# Altium project SolderingStation.PrjPcb
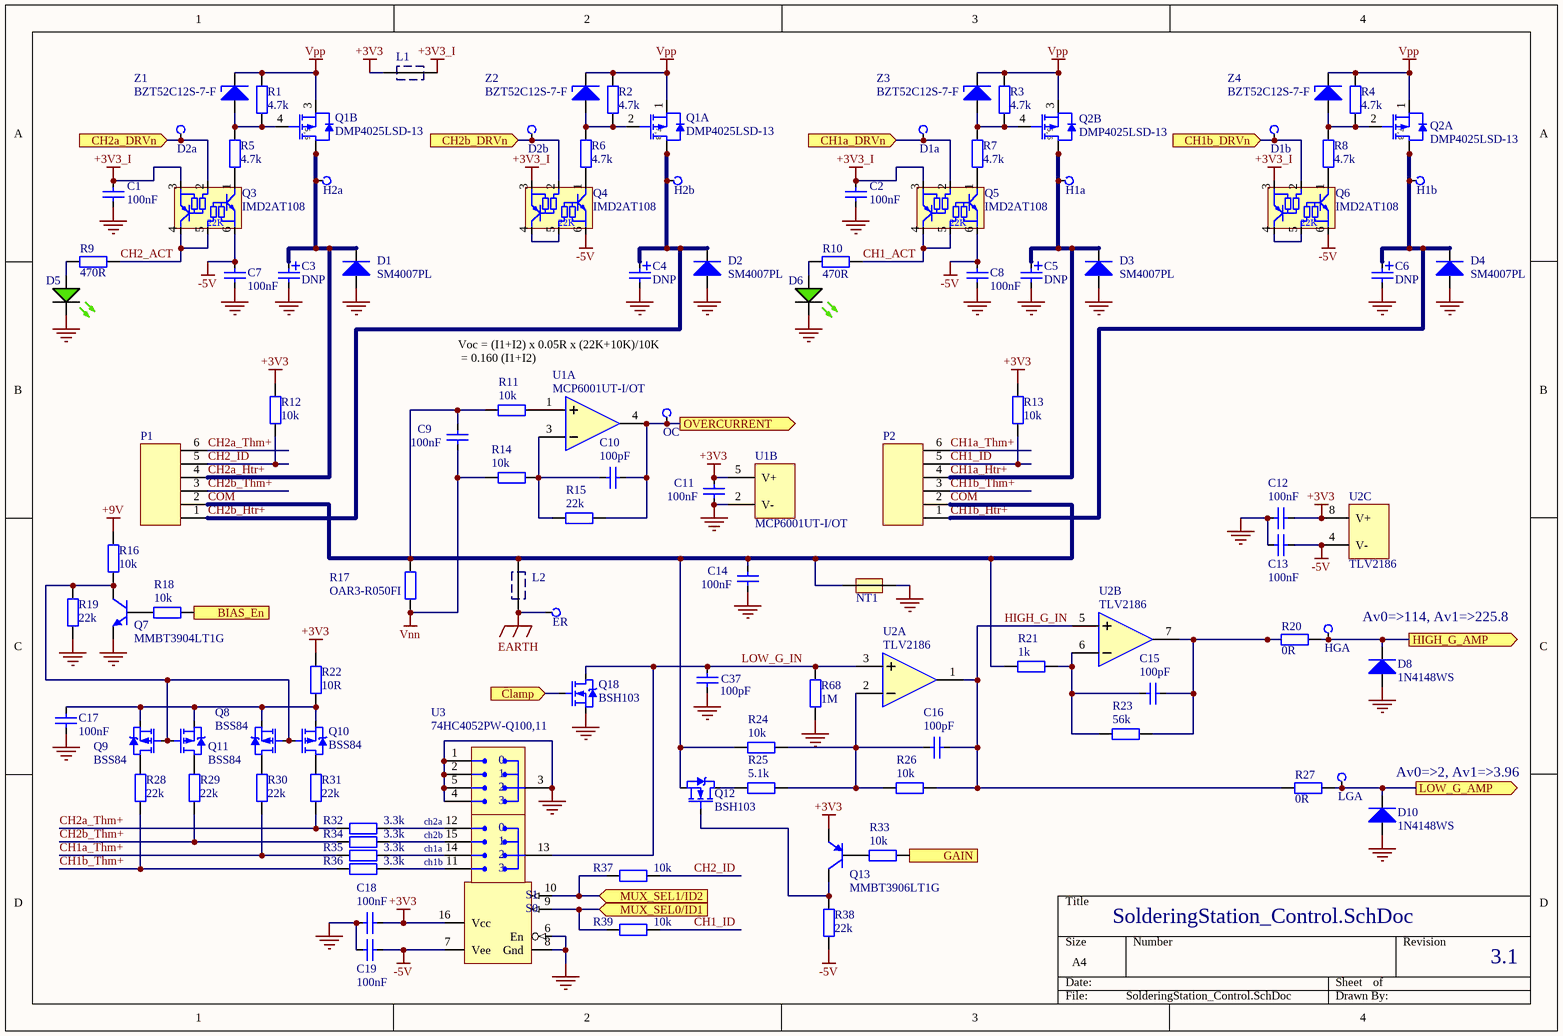
[diagram p0: SolderingStation_Control.SchDoc]
Version: 3.1
3 sheets, 209 parts. Net scope: flat (ports and power ports of the same name join across sheets).
Board file: SolderingStation_ASCII.PcbDoc
Sheets:
  SolderingStation_Control.SchDoc
  SolderingStation_Power.SchDoc
  SolderingStation_Processor.SchDoc

## Sheet SolderingStation_Control.SchDoc
size A4

### Parts
C1  100nF  [CCNP1608-0603_N]
C2  100nF  [CCNP1608-0603_N]
C3  DNP  [CC2012-0805]  (no BOM)
C4  DNP  [CC2012-0805]  (no BOM)
C5  DNP  [CC2012-0805]  (no BOM)
C6  DNP  [CC2012-0805]  (no BOM)
C7  100nF  [CCNP1608-0603_N]
C8  100nF  [CCNP1608-0603_N]
C9  100nF  [CCNP1608-0603_N]
C10  100pF  [CCNP1608-0603_N]
C11  100nF  [CCNP1608-0603_N]
C12  100nF  [CCNP1608-0603_N]
C13  100nF  [CCNP1608-0603_N]
C14  100nF  [CCNP1608-0603_N]
C15  100pF  [CCNP1608-0603_N]
C16  100pF  [CCNP1608-0603_N]
C17  100nF  [CCNP1608-0603_N]
C18  100nF  [CCNP1608-0603_N]
C19  100nF  [CCNP1608-0603_N]
C37  100pF  [CCNP1608-0603_N]
D1  SM4007PL  [SOD-123FL]
D1a  Drive1  [PCBPIN - 0.9mm]  (value not drawn)  (no BOM)
D1b  Drive2  [PCBPIN - 0.9mm]  (value not drawn)  (no BOM)
D2  SM4007PL  [SOD-123FL]
D2a  Drive2  [PCBPIN - 0.9mm]  (value not drawn)  (no BOM)
D2b  Drive2  [PCBPIN - 0.9mm]  (value not drawn)  (no BOM)
D3  SM4007PL  [SOD-123FL]
D4  SM4007PL  [SOD-123FL]
D5  LED  [LED3MM-GREEN - 10mm Proud]  (value not drawn)
D6  LED  [LED3MM-GREEN - 10mm Proud]  (value not drawn)
D8  1N4148WS  [SOD-323]
D10  1N4148WS  [SOD-323]
ER  Gnd  [PCBPIN - 0.9mm]  (value not drawn)  (no BOM)
H1a  Heater1  [PCBPIN - 0.9mm]  (value not drawn)  (no BOM)
H1b  Heater2  [PCBPIN - 0.9mm]  (value not drawn)  (no BOM)
H2a  Heater2  [PCBPIN - 0.9mm]  (value not drawn)  (no BOM)
H2b  Heater2  [PCBPIN - 0.9mm]  (value not drawn)  (no BOM)
HGA  TC1  [PCBPIN - 0.9mm]  (value not drawn)  (no BOM)
L1  Ferrite Bead  [FB2012-0805]  (value not drawn)
L2  Ferrite Bead  [FB2012-0805]  (value not drawn)
LGA  NTC1  [PCBPIN - 0.9mm]  (value not drawn)  (no BOM)
NT1  NetTieVia  [NetTieVia]  (value not drawn)  (net tie, no BOM)
OC  Overcurrent  [PCBPIN - 0.9mm]  (value not drawn)  (no BOM)
P1  MOLEX-43045-0612  [MOLEX-43045-0612]  (value not drawn)
P2  MOLEX-43045-0612  [MOLEX-43045-0612]  (value not drawn)
Q1  DMP4025LSD-13  [SO-8_M]  (parts A,B of 2)
Q2  DMP4025LSD-13  [SO-8_M]  (parts A,B of 2)
Q3  IMD2AT108  [SOT457_N - MIRROR]
Q4  IMD2AT108  [SOT457_N - MIRROR]
Q5  IMD2AT108  [SOT457_N - MIRROR]
Q6  IMD2AT108  [SOT457_N - MIRROR]
Q7  MMBT3904LT1G  [SOT23_N]
Q8  BSS84  [SOT23_M]
Q9  BSS84  [SOT23_M]
Q10  BSS84  [SOT23_M]
Q11  BSS84  [SOT23_M]
Q12  BSH103  [SOT23_N]
Q13  MMBT3906LT1G  [SOT23_N]
Q18  BSH103  [SOT23_N]
R1  4.7k  [CR1608-0603_N]
R2  4.7k  [CR1608-0603_N]
R3  4.7k  [CR1608-0603_N]
R4  4.7k  [CR1608-0603_N]
R5  4.7k  [CR1608-0603_N]
R6  4.7k  [CR1608-0603_N]
R7  4.7k  [CR1608-0603_N]
R8  4.7k  [CR1608-0603_N]
R9  470R  [CR1608-0603_N]
R10  470R  [CR1608-0603_N]
R11  10k  [CR1608-0603_N]
R12  10k  [CR1608-0603_N]
R13  10k  [CR1608-0603_N]
R14  10k  [CR1608-0603_N]
R15  22k  [CR1608-0603_N]
R16  10k  [CR1608-0603_N]
R17  OAR3-R050FI  [OAR3-R050FI]
R18  10k  [CR1608-0603_N]
R19  22k  [CR1608-0603_N]
R20  0R  [CR1608-0603_N]
R21  1k  [CR1608-0603_N]
R22  10R  [CR1608-0603_N]
R23  56k  [CR1608-0603_N]
R24  10k  [CR1608-0603_N]
R25  5.1k  [CR1608-0603_N]
R26  10k  [CR1608-0603_N]
R27  0R  [CR1608-0603_N]
R28  22k  [CR1608-0603_N]
R29  22k  [CR1608-0603_N]
R30  22k  [CR1608-0603_N]
R31  22k  [CR1608-0603_N]
R32  3.3k  [CR1608-0603_N]
R33  10k  [CR1608-0603_N]
R34  3.3k  [CR1608-0603_N]
R35  3.3k  [CR1608-0603_N]
R36  3.3k  [CR1608-0603_N]
R37  10k  [CR1608-0603_N]
R38  22k  [CR1608-0603_N]
R39  10k  [CR1608-0603_N]
R68  1M  [CR1608-0603_N]
U1  MCP6001UT-I/OT  [SOT23-5_M]  (parts A,B of 2)
U2  TLV2186  [SOIC127P600-8M]  (parts A,B,C of 3)
U3  74HC4052PW-Q100,11  [TSSOP16_M]
Z1  BZT52C12S-7-F  [SOD-323]
Z2  BZT52C12S-7-F  [SOD-323]
Z3  BZT52C12S-7-F  [SOD-323]
Z4  BZT52C12S-7-F  [SOD-323]

### Ports
BIAS_En (in), CH1a_DRVn (in), CH1b_DRVn (in), CH2a_DRVn (in), CH2b_DRVn (in), Clamp (in), GAIN (in), HIGH_G_AMP (out), LOW_G_AMP (out), MUX_SEL0/ID1 (in), MUX_SEL1/ID2 (in), OVERCURRENT (out)

### Nets
+3V3: C11.1 C12.1 C18.1 L1.1 Q13.2(E) R12.2 R13.2 R22.1 U1.5(V+) U2.8(V+) U3.16(Vcc)
+3V3_I: C1.1 C2.1 L1.2 Q3.3(E2) Q4.3(E2) Q5.3(E2) Q6.3(E2)
+9V: R16.1
-5V: C7.1 C8.1 C13.1 C19.1 Q3.6(E1) Q4.6(E1) Q5.6(E1) Q6.6(E1) R38.1 U2.4(V-) U3.7(Vee)
EARTH: ER.1(TP) L2.1
GND: C1.2 C2.2 C3.2 C4.2 C5.2 C6.2 C7.2 C8.2 C11.2 C12.2 C13.2 C14.2 C17.1 C18.2 C19.2 C37.1 D1.A D2.A D3.A D4.A D5.K D6.K D8.A D10.A NT1.1 Q7.2(E) Q18.2(S) R19.1 R68.1 U1.2(V-) U3.1(2Y0) U3.2(2Y2) U3.3(2Z) U3.4(2Y3) U3.5(2Y1) U3.6(En) U3.8(Gnd)
Vnn: C9.2 R14.2 R17.1
Vpp: Q1.1(S1) Q1.3(S2) Q2.1(S1) Q2.3(S2) R1.2 R2.2 R3.2 R4.2 Z1.K Z2.K Z3.K Z4.K
BIAS_En: R18.2 ; port BIAS_En
CH1_ACT: Q5.4(C2) Q5.5(B1) R10.2
CH1_ID: P2.5 R13.1 R39.1
CH1a_DRVn: D1a.1(TP) Q5.2(B2) ; port CH1a_DRVn
CH1a_Htr+: C5.1 D3.K H1a.1(TP) P2.4 Q2.5(D2) Q2.6(D2)
CH1a_Thm+: P2.6 R30.1 R35.2
CH1b_DRVn: D1b.1(TP) Q6.2(B2) ; port CH1b_DRVn
CH1b_Htr+: C6.1 D4.K H1b.1(TP) P2.1 Q2.7(D1) Q2.8(D1)
CH1b_Thm+: P2.3 R28.1 R36.2
CH2_ACT: Q3.4(C2) Q3.5(B1) R9.2
CH2_ID: P1.5 R12.1 R37.1
CH2a_DRVn: D2a.1(TP) Q3.2(B2) ; port CH2a_DRVn
CH2a_Htr+: C3.1 D1.K H2a.1(TP) P1.4 Q1.5(D2) Q1.6(D2)
CH2a_Thm+: P1.6 R31.1 R32.2
CH2b_DRVn: D2b.1(TP) Q4.2(B2) ; port CH2b_DRVn
CH2b_Htr+: C4.1 D2.K H2b.1(TP) P1.1 Q1.7(D1) Q1.8(D1)
CH2b_Thm+: P1.3 R29.1 R34.2
Clamp: Q18.1(G) ; port Clamp
COM: C9.1 C14.1 L2.2 NT1.2 P1.2 P2.2 Q12.2(S) R11.2 R17.2 R21.2 R24.1
GAIN: R33.2 ; port GAIN
HIGH_G_AMP: D8.K HGA.1(TP) R20.1 ; port HIGH_G_AMP
HIGH_G_IN: C16.2 R26.2 R27.2 U2.1(A) U2.5(B+)
LOW_G_AMP: D10.K LGA.1(TP) R27.1 ; port LOW_G_AMP
LOW_G_IN: C37.2 Q18.3(D) R68.2 U2.3(A+) U3.13(1Z)
MUX_SEL0/ID1: R39.2 U3.9(S1) ; port MUX_SEL0/ID1
MUX_SEL1/ID2: R37.2 U3.10(S0) ; port MUX_SEL1/ID2
OVERCURRENT: C10.2 OC.1(TP) R15.2 U1.4(Out) ; port OVERCURRENT
NetC10_1: C10.1 R14.1 R15.1 U1.3(In-)
NetC15_1: C15.1 R21.1 R23.1 U2.6(B-)
NetC15_2: C15.2 R20.2 R23.2 U2.7
NetC16_1: C16.1 R24.2 R25.1 R26.1 U2.2(A-)
NetC17_2: C17.2 Q8.2(S) Q9.2(S) Q10.2(S) Q11.2(S) R22.2
NetD5_A: D5.A R9.1
NetD6_A: D6.A R10.1
NetQ1_2: Q1.2(G1) R2.1 R6.2 Z2.A
NetQ1_4: Q1.4(G2) R1.1 R5.2 Z1.A
NetQ2_2: Q2.2(G1) R4.1 R8.2 Z4.A
NetQ2_4: Q2.4(G2) R3.1 R7.2 Z3.A
NetQ3_1: Q3.1(C1) R5.1
NetQ4_1: Q4.1(C1) R6.1
NetQ4_4: Q4.4(C2) Q4.5(B1)
NetQ5_1: Q5.1(C1) R7.1
NetQ6_1: Q6.1(C1) R8.1
NetQ6_4: Q6.4(C2) Q6.5(B1)
NetQ7_1: Q7.1(B) R18.1
NetQ7_3: Q7.3(C) Q8.1(G) Q9.1(G) Q10.1(G) Q11.1(G) R16.2 R19.2
NetQ8_3: Q8.3(D) R30.2
NetQ9_3: Q9.3(D) R28.2
NetQ10_3: Q10.3(D) R31.2
NetQ11_3: Q11.3(D) R29.2
NetQ12_1: Q12.1(G) Q13.3(C) R38.2
NetQ12_3: Q12.3(D) R25.2
NetQ13_1: Q13.1(B) R33.1
NetR11_1: R11.1 U1.1(In+)
NetR32_1: R32.1 U3.12(1Y0)
NetR34_1: R34.1 U3.15(1Y2)
NetR35_1: R35.1 U3.14(1Y1)
NetR36_1: R36.1 U3.11(1Y3)

### Notes on the sheet
- Voc = (I1+I2) x 0.05R x (22K+10K)/10K
  = 0.160 (I1+I2)
- Av0=>114, Av1=>225.8
- (near D10) Av0=>2, Av1=>3.96
- (near U3) ch1a
- (near U3) ch2a
- (near U3) ch2b
- (near U3) ch1b
- (in symbol 74HC4052PW-Q100,11) 0
- (in symbol DMP4025LSD-13, part A) 7, 8
- (in symbol DMP4025LSD-13, part B) 5, 6
- (in symbol IMD2AT108) 22K

### Library data of the parts
C1 C2 C7-C9 C11-C14 C17-C19 = Cap_CCNP_0603_100nF: Capacitor non-polar SMT 0603; Manufacturer: Generic Components; Class: Passive; Published: 08/06/2000; Publisher: Altium Hobart Technology Centre; SubClass: Capacitor; Farnell PN: *; Digikey: *; Value: 100nF; LCSC: C14663
C3-C6 = Cap_CC_0805: Capacitor SMT 0805; Manufacturer: Generic Components; Class: Passive; Published: 08/06/2000; Publisher: Altium Hobart Technology Centre; SubClass: Capacitor; Farnell PN: *; Digikey: *; Value: DNP
C10 C15 C16 C37 = Cap_CCNP_0603_100pF: Capacitor non-polar SMT 0603; Manufacturer: Generic Components; Class: Passive; Published: 08/06/2000; Publisher: Altium Hobart Technology Centre; SubClass: Capacitor; Farnell PN: *; Digikey: *; Value: 100pF; LCSC: C14858
D1-D4 = SM4007PL: Diodes - General Purpose, 1kV 1A 1.1V 1A SOD-123FL; Class: Discrete; SubClass: Diode - Switching; Digikey: *; Farnell PN: *; LCSC: C64898
D1a D1b D2a D2b ER H1a H1b H2a H2b HGA LGA OC = TP: Test Point; Digikey: *; Farnell PN: *; LCSC: *
D5 D6 = LED_3MM_GREEN: 3mm Green LED; Manufacturer: Generic Components; Class I: Optoelectronic; Published: 8-Jun-2000; Revision: July-2002: Re-released for DXP Platform.; Publisher: Altium Limited; Class II: LED; Digikey: *; Farnell PN: *; LCSC: *
D8 D10 = 1N4148WS: Switching Diode 100V 150mA 1.25V@150mA 4ns SOD-323; Class: Discrete; SubClass: Diode - Switching; Digikey: *; Farnell PN: 2675146; LCSC: C2128
L1 L2 = Ferrite Bead 0805: Ferrite Bead SMT 0805, TDK MPZ2012S102AT, 0.15OHM, 1.5A; Farnell PN: 1669733; Digikey: *; LCSC: C1017
P1 P2 = MOLEX-43045-0612: Wire-To-Board Connector, With Polarizing Peg, 3 mm, 6 Contacts, Header, Micro-Fit 3.0 43045 Series; Farnell PN: 1012248
Q1 Q2 = DMP4025LSD-13: P-Channel dual MOSFET, 40 V, 7.6 A, 0.018 ohm, SOIC, Surface Mount; Farnell: 2543521
Q3-Q6 = IMD2AT108: Pre-Biased NPN and PNP pair, 50 V, 100 mA, 22 kohm, 22 kohm; LCSC: C509889; Farnell PN: 1680329
Q7 = MMBT3904LT1G: General Purpose Transistor, NPN Silicon, 3-Pin SOT-23, Pb-Free, Tape and Reel; Manufacturer: On Semiconductor; IC Continuous (A): 0.2; fT Min (MHz): 300; ComponentLink2Description: Datasheet; Polarity: NPN; PackageDescription: 3-Pin Small Outline Transistor, Body 2.92 x 1.3 mm, Pitch 0.95 mm; ComponentLink2URL: http://www.onsemi.cn/pub_link/Collateral/MMBT3904LT1-D.PDF; DatasheetVersion: Rev. 12; Mounting Technology: Surface Mount; PartNumber: MMBT3904LT1G; ComponentLink1URL: http://www.onsemi.com/; ComponentLink3Description: Package Specification; ComponentLink1Description: Manufacturer URL; PackageVersion: Rev. AP, 11/2009; PackageReference: SOT-23-3-318-08; Packing: Tape and Reel; ComponentLink3URL: http://www.onsemi.cn/pub_link/Collateral/318-08.PDF; RoHS: TRUE; LCSC: C20526
Q8-Q11 = BSS84: P-Channel Enhancement Mode FET -0.13 A, -50 V,  RDS(ON) = 10R at VGS = -5 V; Digikey: *; Farnell PN: *; LCSC: C8492
Q12 Q18 = BSH103: N-channel enhancement mode FET, , 30 V, 850 mA, 0.4 ohm, SOT23; PackageDescription: SOT-23; 3 Leads; Body 3.1 x 2.5 mm, inc. leads (LxW max), Alternate Lead Configuration; ComponentLink1Description: Manufacturer Link; ComponentLink1URL: http://www.zetex.com/; ComponentLink2Description: Datasheet; ComponentLink2URL: www.zetex.com/3.0/pdf/BSS138.pdf; Farnell PN: 1081307; Digikey: *; LCSC: C88711
Q13 = MMBT3906LT1G: General Purpose Transistor, PNP Silicon, 3-Pin SOT-23, Pb-Free, Tape and Reel; Manufacturer: On Semiconductor; IC Continuous (A): -0.2; fT Min (MHz): 250; PackageDescription: 3-Pin Small Outline Transistor, Body 2.92 x 1.3 mm, Pitch 0.95 mm; PartNumber: MMBT3906LT1G; Packing: Tape and Reel; ComponentLink3Description: Package Specification; Mounting Technology: Surface Mount; ComponentLink3URL: http://www.onsemi.cn/pub_link/Collateral/318-08.PDF; ComponentLink1URL: http://www.onsemi.com/; ComponentLink2URL: http://www.onsemi.cn/pub_link/Collateral/MMBT3906LT1-D.PDF; PackageReference: SOT-23-3-318-08; Polarity: PNP; ComponentLink2Description: Datasheet; PackageVersion: Rev. AP, 11/2009; RoHS: TRUE; DatasheetVersion: Rev. 11; ComponentLink1Description: Manufacturer URL; LCSC: C53444
R1-R8 = Res_CR0603_4k7: Resistor SMT 0603; Manufacturer: Generic Components; Class: Passive; Published: 08/06/2000; Publisher: Altium Hobart Technology Centre; SubClass: Resistor; Farnell PN: *; Digikey: *; LCSC: C23162; Value: 4.7k
R9 R10 = Res_CR0603_470R: Resistor SMT 0603; Manufacturer: Generic Components; Class: Passive; Published: 08/06/2000; Publisher: Altium Hobart Technology Centre; SubClass: Resistor; Farnell PN: *; Digikey: *; Value: 470R; LCSC: C23179
R11-R14 R16 R18 R24 R26 R33 R37 R39 = Res_CR0603_10k: Resistor SMT 0603; Manufacturer: Generic Components; Class: Passive; Published: 08/06/2000; Publisher: Altium Hobart Technology Centre; SubClass: Resistor; Farnell PN: *; Digikey: *; Value: 10k; LCSC: C25804
R15 R19 R28-R31 R38 = Res_CR0603_22k: Resistor SMT 0603; Manufacturer: Generic Components; Class: Passive; Published: 08/06/2000; Publisher: Altium Hobart Technology Centre; SubClass: Resistor; Farnell PN: *; Digikey: *; LCSC: C31850; Value: 22k
R17 = OAR3-R050FI: Current Sense Resistor, 0.05 ohm, OAR Series, 3 W, Metal Strip, Radial Leaded, 1%
R20 R27 = Res_CR0603_0R: Resistor SMT 0603; Manufacturer: Generic Components; Class: Passive; Published: 08/06/2000; Publisher: Altium Hobart Technology Centre; SubClass: Resistor; Farnell PN: *; Digikey: *; LCSC: C21189; Value: 0R
R21 = Res_CR0603_1k: Resistor SMT 0603; Manufacturer: Generic Components; Class: Passive; Published: 08/06/2000; Publisher: Altium Hobart Technology Centre; SubClass: Resistor; Farnell PN: *; Digikey: *; LCSC: C21190; Value: 1k
R22 = Res_CR0603_10R: Resistor SMT 0603; Manufacturer: Generic Components; Class: Passive; Published: 08/06/2000; Publisher: Altium Hobart Technology Centre; SubClass: Resistor; Farnell PN: *; Digikey: *; Value: 10R; LCSC: C22978
R23 = Res_CR0603_56k: Resistor SMT 0603; Manufacturer: Generic Components; Class: Passive; Published: 08/06/2000; Publisher: Altium Hobart Technology Centre; SubClass: Resistor; Farnell PN: *; Digikey: *; LCSC: C23206; Value: 56k
R25 = Res_CR0603_5k1: Resistor SMT 0603; Manufacturer: Generic Components; Class: Passive; Published: 08/06/2000; Publisher: Altium Hobart Technology Centre; SubClass: Resistor; Farnell PN: *; Digikey: *; LCSC: C23186; Value: 5.1k
R32 R34-R36 = Res_CR0603_3k3: Resistor SMT 0603; Manufacturer: Generic Components; Class: Passive; Published: 08/06/2000; Publisher: Altium Hobart Technology Centre; SubClass: Resistor; Farnell PN: *; Digikey: *; LCSC: C22978; Value: 3.3k
R68 = Res_CR0603_1M: Resistor SMT 0603; Manufacturer: Generic Components; Class: Passive; Published: 08/06/2000; Publisher: Altium Hobart Technology Centre; SubClass: Resistor; Farnell PN: *; Digikey: *; LCSC: C25804; Value: 1M
U1 = MCP6001UT-I/OT: Op-Amp, Single supply R-R in/out; Digikey: *; Farnell PN: *; LCSC: C21403
U2 = TLV2186: Dual Precision,Rail-to-Rail Input and Output, 4.5-24V, Zero-Drift OperationalAmplifier
U3 = 74HC4052PW-Q100,11: Analog Multiplexer / Demultiplexer, 4:1, 2 Circuits, 225 ohm, 2V to 10V, TSSOP-16; Farnell PN: 2445305; LCSC: C547006
Z1-Z4 = BZT52C12S-7-F: Surface Mount Zener Diode, 12-13 V, -65 to 150 degC, SOD-123; LCSC: C124208
NT1 = NetTieVia: LCSC: *

## Sheet SolderingStation_Power.SchDoc
size A4
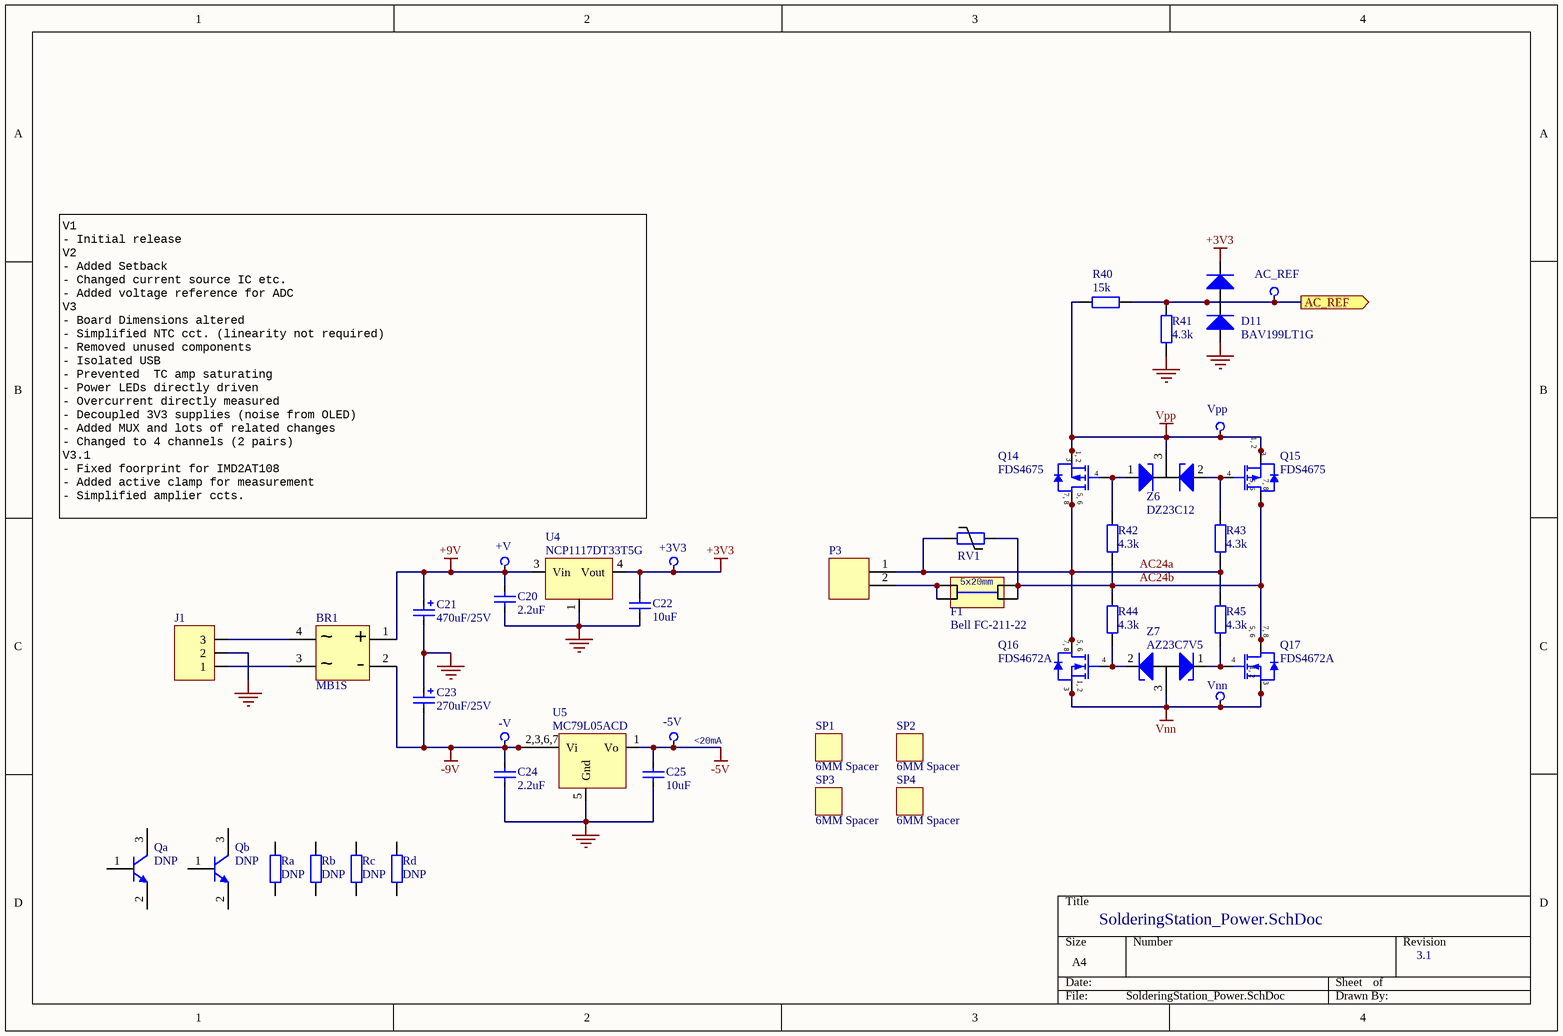
[diagram p1: SolderingStation_Power.SchDoc]

### Parts
+3V3  +3.3 volt  [PCBPIN - 0.9mm]  (value not drawn)  (no BOM)
+V  9 volt unregulated  [PCBPIN - 0.9mm]  (value not drawn)  (no BOM)
-5V  -5 volt  [PCBPIN - 0.9mm]  (value not drawn)  (no BOM)
-V  -9 volt unregulated  [PCBPIN - 0.9mm]  (value not drawn)  (no BOM)
AC_REF  Vdd  [PCBPIN - 0.9mm]  (value not drawn)  (no BOM)
BR1  MB1S  [MB1S]
C20  2.2uF  [CCNP2012-0805]
C21  470uF/25V  [RB5/10x13mm]
C22  10uF  [CCNP2012-0805]
C23  270uF/25V  [RB5/10x13mm]
C24  2.2uF  [CCNP2012-0805]
C25  10uF  [CCNP2012-0805]
D11  BAV199LT1G  [SOT23_M]
F1  Bell FC-211-22  [FUSE_CLIP_5x20]
J1  JST XH Connector, 3-Pin  [jst-b3b-xh-ax]  (value not drawn)
P3  Terminal2  [MOLEX-39544-3002]  (value not drawn)
Q14  FDS4675  [SO-8_M]
Q15  FDS4675  [SO-8_M]
Q16  FDS4672A  [SO-8_M]
Q17  FDS4672A  [SO-8_M]
Qa  DNP  [SOT23_M]  (no BOM)
Qb  DNP  [SOT23_M]  (no BOM)
R40  15k  [CR1608-0603_N]
R41  4.3k  [CR1608-0603_N]
R42  4.3k  [CR1608-0603_N]
R43  4.3k  [CR1608-0603_N]
R44  4.3k  [CR1608-0603_N]
R45  4.3k  [CR1608-0603_N]
Ra  DNP  [CR1608-0603_N]  (no BOM)
Rb  DNP  [CR1608-0603_N]  (no BOM)
Rc  DNP  [CR1608-0603_N]  (no BOM)
Rd  DNP  [CR1608-0603_N]  (no BOM)
RV1  V33MLA1206NHAUTO  [VR3216-1206]  (value not drawn)
SP1  6MM Spacer  [Spacer-2mm dia x 6mm]
SP2  6MM Spacer  [Spacer-2mm dia x 6mm]
SP3  6MM Spacer  [Spacer-2mm dia x 6mm]
SP4  6MM Spacer  [Spacer-2mm dia x 6mm]
U4  NCP1117DT33T5G  [TO-252]
U5  MC79L05ACD  [SOIC127P600-8N]
Vnn  Power Ground  [PCBPIN - 0.9mm]  (value not drawn)  (no BOM)
Vpp  Power +V  [PCBPIN - 0.9mm]  (value not drawn)  (no BOM)
Z6  DZ23C12  [SOT23_M]
Z7  AZ23C7V5  [SOT23_M]

### Ports
AC_REF (out)

### Nets
+3V3: +3V3.1(TP) C22.2 D11.2(A2) U4.4(Vout)
+9V: +V.1(TP) BR1.1 C20.2 C21.1 U4.3(Vin)
-5V: -5V.1(TP) C25.2 U5.1(Vo)
-9V: -V.1(TP) BR1.2 C23.2 C24.2 U5.2(Vi) U5.3(Vi) U5.6(Vi) U5.7(Vi)
GND: C20.1 C21.2 C22.1 C23.1 C24.1 C25.1 D11.1(A1) J1.2 R41.1 U4.1(Gnd) U5.5(Gnd)
Vnn: Q16.1(S) Q16.2(S) Q16.3(S) Q17.1(S) Q17.2(S) Q17.3(S) Vnn.1(TP) Z7.3(K)
Vpp: Q14.1(S) Q14.2(S) Q14.3(S) Q15.1(S) Q15.2(S) Q15.3(S) R40.1 Vpp.1(TP) Z6.3(K)
AC24a: P3.1 Q14.5(D) Q14.6(D) Q14.7(D) Q14.8(D) Q16.5(D) Q16.6(D) Q16.7(D) Q16.8(D) R43.1 R45.2 RV1.2
AC24b: F1.2 F1.2a Q15.5(D) Q15.6(D) Q15.7(D) Q15.8(D) Q17.5(D) Q17.6(D) Q17.7(D) Q17.8(D) R42.1 R44.2 RV1.1
AC_REF: AC_REF.1(TP) D11.3(K) R40.2 R41.2 ; port AC_REF
NetBR1_3: BR1.3 J1.1
NetBR1_4: BR1.4 J1.3
NetF1_1: F1.1 F1.1a P3.2
NetQ14_4: Q14.4(G) R42.2 Z6.1(A1)
NetQ15_4: Q15.4(G) R43.2 Z6.2(A2)
NetQ16_4: Q16.4(G) R44.1 Z7.2(A2)
NetQ17_4: Q17.4(G) R45.1 Z7.1(A1)

Not connected (* = marked no-connect by the designer): Qa 1(B) 2(E) 3(C); Qb 1(B) 2(E) 3(C); Ra 1 2; Rb 1 2; Rc 1 2; Rd 1 2; U5 4(NC) 8(NC)

### Notes on the sheet
- V1
  - Initial release
  V2
  - Added Setback
  - Changed current source IC etc.
  - Added voltage reference for ADC
  V3
  - Board Dimensions altered
  - Simplified NTC cct. (linearity not required)
  - Removed unused components
  - Isolated USB
  - Prevented  TC amp saturating
  - Power LEDs directly driven
  - Overcurrent directly measured
  - Decoupled 3V3 supplies (noise from OLED)
  - Added MUX and lots of related changes
  - Changed to 4 channels (2 pairs)
  V3.1
  - Fixed foorprint for IMD2AT108
  - Added active clamp for measurement
  - Simplified amplier ccts.
- (near -5V) <20mA
- (in symbol FDS4672A) 7, 8; 5, 6; 1, 2
- (in symbol FUSE_CLIP_5x20) 5x20mm
- (in symbol MB1S) ~; +; -
- (in symbol MC79L05ACD) 2,3,6,7
- (in symbol IMD2AT108) 22K

### Library data of the parts
+3V3 +V -5V -V AC_REF Vnn Vpp = TP: Test Point; Digikey: *; Farnell PN: *; LCSC: *
BR1 = MB1S: Bridge Rectifier Diode, Single Phase, 100 V, 800 mA, SOIC, 1.1 V, 4 Pins; LCSC: C232821
C20 C24 = Cap_CCNP_0805_2u2F: Capacitor non-polar SMT 0805; Manufacturer: Generic Components; Class: Passive; Published: 08/06/2000; Publisher: Altium Hobart Technology Centre; SubClass: Capacitor; Farnell PN: *; Digikey: *; LCSC: C49217; Value: 2.2uF
C21 C23 = Cap-RB5/10x16MM
  C21: value: 470uF/25V
  C23: value: 270uF/25V
C22 C25 = Cap_CCNP_0805_10uF: Capacitor non-polar SMT 0805; Manufacturer: Generic Components; Class: Passive; Published: 08/06/2000; Publisher: Altium Hobart Technology Centre; SubClass: Capacitor; Farnell PN: *; Digikey: *; Value: 10uF; LCSC: C15850
D11 = BAV199LT1G: Dual Series low-leakage switching diodes, 3-Pin SOT-23; Digikey: BAV199LT1GOSCT-ND; Farnell PN: 1431115; LCSC: C145516
F1 = FUSE_CLIP_5x20: 5x20mm fuse clip PCB Mount; Value: 10 A; Digikey: 507-1415-ND
J1 = JST-B3B-XH-A: LatestRevisionDate: 17-Jul-2002; LatestRevisionNote: Re-released for DXP Platform.; Publisher: Altium Limited; LCSC: *; Farnell PN: 1516277; Digikey: 455-2248-ND
P3 = Terminal2: MULTICOMP  MC24366 Wire-To-Board Terminal Block; Farnell PN: 2396251; LCSC: *
Q14 Q15 = FDS4675: P-Channel Power MOSFET, 11 A, 40 V, RDS(ON) = 0.013 ohm @ VGS = -10   VRDS(ON) = 0.017 ohm @ VGS =   -4.5 VC; Manufacturer: Fairchild Semiconductor; Package Version: Rev. 16, 08/2015; Qg Gate Charge: 56nC; Drain-to-Source Voltage [Vdss]: 40V; Drain-Source On Resistance-Max: 13mO; Rated Power Dissipation: 2.4W; Datasheet Version: Rev. C(W), 02/2001; Package Description: 8-Pin Small Outline Integrated Circuit, Body 4.9 x 3.9 mm, Pitch 1.27 mm; Channel Type: P-Channel; Datasheet URL: https://www.fairchildsemi.com/datasheets/FD/FDS4675.pdf; Package URL: https://www.fairchildsemi.com/package-drawings/M0/M08A.pdf; Package Reference: SO-8; Mounting Technology: SurfaceMount; Manufacturer URL: https://www.fairchildsemi.com/; Temperature: 25
Q16 Q17 = FDS4672A: N-Channel Power MOSFET, 11 A, 40 V. RDS(ON)  = .013 ohm @ VGS = 4.5 V; Manufacturer: Fairchild Semiconductor; Package Version: Rev. 16, 08/2015; Channel Type: P-Channel; Qg Gate Charge: 56nC; Drain-to-Source Voltage [Vdss]: 40V; Drain-Source On Resistance-Max: 13mO; Rated Power Dissipation: 2.4W; Datasheet Version: Rev. C(W), 02/2001; Package Description: 8-Pin Small Outline Integrated Circuit, Body 4.9 x 3.9 mm, Pitch 1.27 mm; Datasheet URL: https://www.fairchildsemi.com/datasheets/FD/FDS4675.pdf; Package URL: https://www.fairchildsemi.com/package-drawings/M0/M08A.pdf; Package Reference: SO-8; Mounting Technology: SurfaceMount; Manufacturer URL: https://www.fairchildsemi.com/; LCSC: C725034
Qa Qb = MMBT3904LT1G: SOT23; ComponentLink2Description: Datasheet; ComponentLink2URL: http://www.onsemi.cn/pub_link/Collateral/MMBT3904LT1-D.PDF; ComponentLink1URL: http://www.onsemi.com/; ComponentLink3Description: Package Specification; ComponentLink1Description: Manufacturer URL; ComponentLink3URL: http://www.onsemi.cn/pub_link/Collateral/318-08.PDF
R40 = Res_CR0603_15k: Resistor SMT 0603; Manufacturer: Generic Components; Class: Passive; Published: 08/06/2000; Publisher: Altium Hobart Technology Centre; SubClass: Resistor; Farnell PN: *; Digikey: *; LCSC: C22809; Value: 15k
R41-R45 = Res_CR0603_4k3: Resistor SMT 0603; Manufacturer: Generic Components; Class: Passive; Published: 08/06/2000; Publisher: Altium Hobart Technology Centre; SubClass: Resistor; Farnell PN: *; Digikey: *; LCSC: C23159; Value: 4.3k
Ra Rb Rc Rd = Res_CR0603: Resistor SMT 0603; Manufacturer: Generic Components; Class: Passive; Published: 08/06/2000; Publisher: Altium Hobart Technology Centre; SubClass: Resistor; Farnell PN: *; Digikey: *; Value: DNP
RV1 = V33MLA1206NHAUTO: V33MLA1206NH - TVS Varistor, 26 V, 33 V, MLA Series, 75 V, 1206 [3216 Metric], Multilayer Varistor (MLV); Manufacturer: Generic Components; Class: Passive; SubClass: Resistor; Published: 08/06/2000; Publisher: Altium Hobart Technology Centre; Farnell PN: 1816942; Digikey: F11298CT-ND; LCSC: *
SP1-SP4 = Spacer-6mm
U4 = NCP1117DT33T5G: IC REG LINEAR +3V3 1A TO252-3; Farnel: 2464254; DigiKey: NCP1117DT33T5GOSCT-ND; LCSC: C152529
U5 = MC79L05ACD: IC REG LINEAR -5V 100MA SOIC-8; DigiKey: UA79M05CKVURG3; LCSC: C154823; Farnell PN: 3122804
Z6 = DZ23Cxx: Dual silicon planar Zener diodes; Digikey: *; Farnell PN: *; LCSC: *
Z7 = AZ23Cxx: Dual silicon planar Zener diodes; Digikey: *; Farnell PN: *; LCSC: *

## Sheet SolderingStation_Processor.SchDoc
size A4
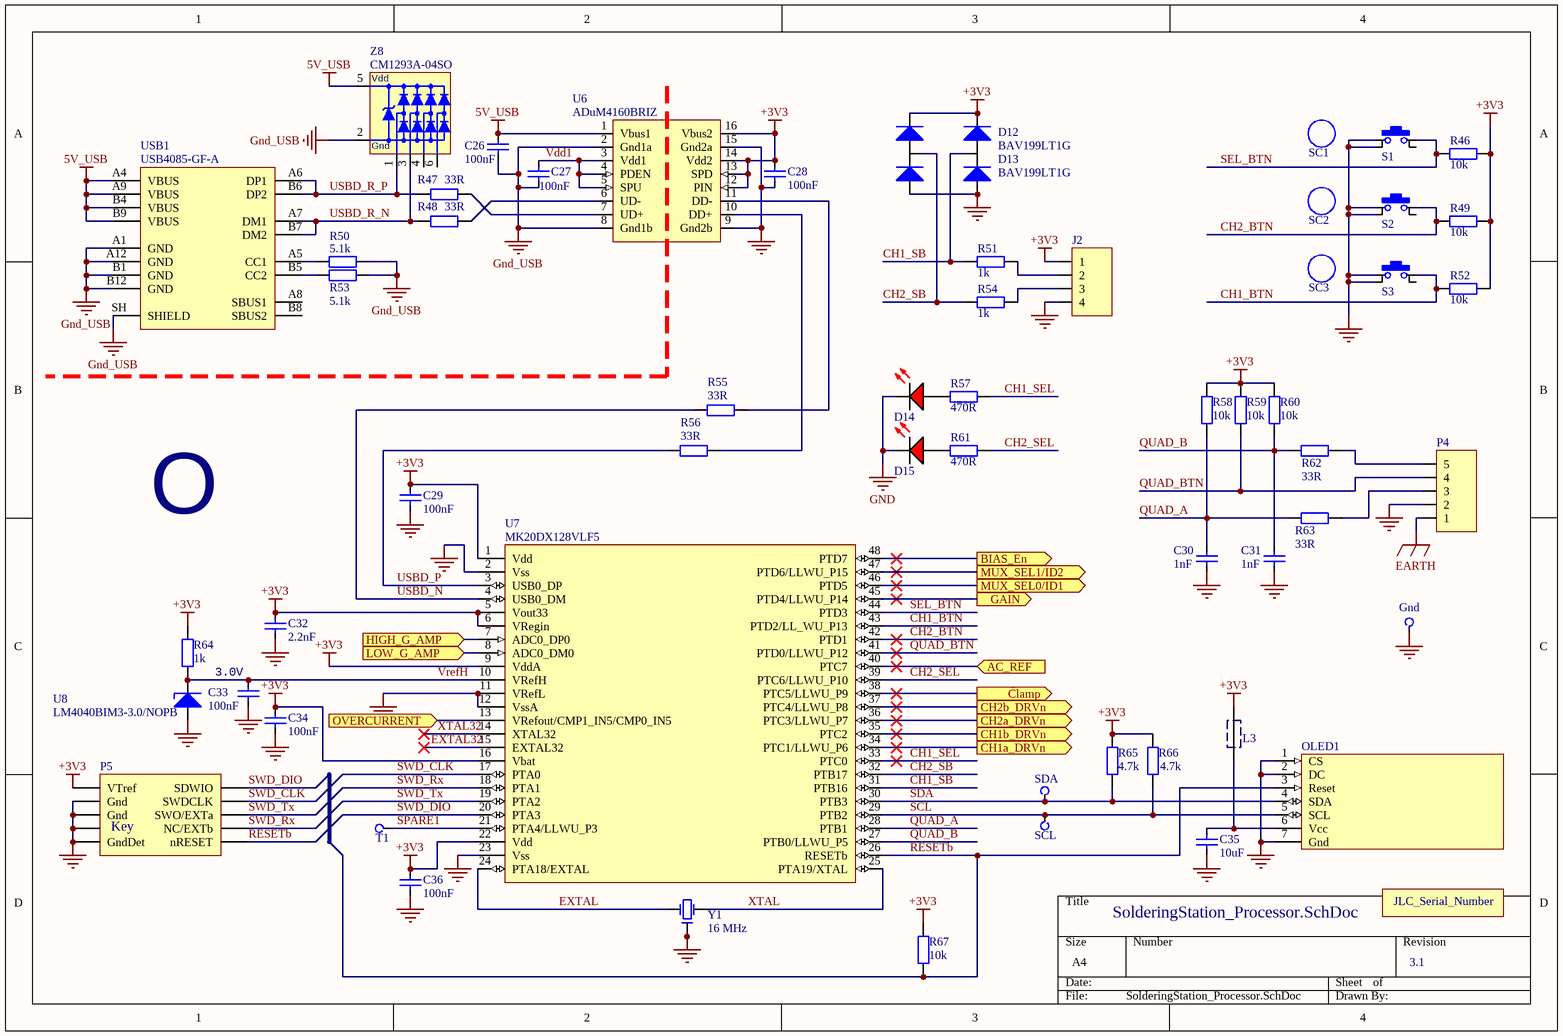
[diagram p2: SolderingStation_Processor.SchDoc]

### Parts
C26  100nF  [CCNP1608-0603_N]
C27  100nF  [CCNP1608-0603_N]
C28  100nF  [CCNP1608-0603_N]
C29  100nF  [CCNP1608-0603_N]
C30  1nF  [CCNP1608-0603_N]
C31  1nF  [CCNP1608-0603_N]
C32  2.2nF  [CCNP1608-0603_N]
C33  100nF  [CCNP1608-0603_N]
C34  100nF  [CCNP1608-0603_N]
C35  10uF  [CCNP2012-0805]
C36  100nF  [CCNP1608-0603_N]
D12  BAV199LT1G  [SOT23_M]
D13  BAV199LT1G  [SOT23_M]
D14  LED  [LED3MM-RED - 10mm Proud]  (value not drawn)
D15  LED  [LED3MM-RED - 10mm Proud]  (value not drawn)
Gnd  Gnd  [PCBPIN - 0.9mm]  (value not drawn)  (no BOM)
J2  JST XH Connector, 4-Pin  [jst-b4b-xh-ax]  (value not drawn)
JLC_Serial_Number1  JLC_Serial_Number  [JLC_Serial_Number]  (value not drawn)  (no BOM)
L3  Ferrite Bead  [FB2012-0805]  (value not drawn)
Logo1  OSHW Logo  [OSHW]  (value not drawn)  (no BOM)
OLED1  OLED_Display  [OLED_Display_128x64_2.4inch - no mounting holes]  (value not drawn)
P4  Header, 5-Pin  [HDR1X5S]  (value not drawn)
P5  SWD Connector 2x5-Pin  [SWD-2x5-Jig-Header]  (value not drawn)  (no BOM)
R46  10k  [CR1608-0603_N]
R47  33R  [CR1608-0603_N]
R48  33R  [CR1608-0603_N]
R49  10k  [CR1608-0603_N]
R50  5.1k  [CR1608-0603_N]
R51  1k  [CR1608-0603_N]
R52  10k  [CR1608-0603_N]
R53  5.1k  [CR1608-0603_N]
R54  1k  [CR1608-0603_N]
R55  33R  [CR1608-0603_N]
R56  33R  [CR1608-0603_N]
R57  470R  [CR1608-0603_N]
R58  10k  [CR1608-0603_N]
R59  10k  [CR1608-0603_N]
R60  10k  [CR1608-0603_N]
R61  470R  [CR1608-0603_N]
R62  33R  [CR1608-0603_N]
R63  33R  [CR1608-0603_N]
R64  1k  [CR1608-0603_N]
R65  4.7k  [CR1608-0603_N]
R66  4.7k  [CR1608-0603_N]
R67  10k  [CR1608-0603_N]
S1  SW_PB-B3F1052  [SW_MIN_PB-B3F1052]  (value not drawn)
S2  SW_PB-B3F1052  [SW_MIN_PB-B3F1052]  (value not drawn)
S3  SW_PB-B3F1052  [SW_MIN_PB-B3F1052]  (value not drawn)
SC1  B32-2010  [SW-CAP-B32-2010]  (value not drawn)
SC2  B32-2010  [SW-CAP-B32-2010]  (value not drawn)
SC3  B32-2010  [SW-CAP-B32-2010]  (value not drawn)
SCL  SCL  [PCBPIN - 0.9mm]  (value not drawn)  (no BOM)
SDA  SDA  [PCBPIN - 0.9mm]  (value not drawn)  (no BOM)
T1  PTA4  [PCBPIN - 0.9mm]  (value not drawn)  (no BOM)
U6  ADuM4160BRIZ  [SOIC127P1030-16M]
U7  MK20DX128VLF5  [TSQFP50P900X900-48M]
U8  LM4040BIM3-3.0/NOPB  [SOT23_M]
USB1  USB4085-GF-A  [USB4085-GF-A]
Y1  16 MHz  [Crystal_SMD_3.2x2.5]
Z8  CM1293A-04SO  [SOT457_M - 180]

### Ports
AC_REF (in), BIAS_En (out), CH1a_DRVn (out), CH1b_DRVn (out), CH2a_DRVn (out), CH2b_DRVn (out), Clamp (out), GAIN (out), HIGH_G_AMP (in), LOW_G_AMP (in), MUX_SEL0/ID1 (out), MUX_SEL1/ID2 (out), OVERCURRENT (in)

### Nets
5V_USB: C26.2 U6.1(Vbus1) USB1.A4(VBUS) USB1.A9(VBUS) USB1.B4(VBUS) USB1.B9(VBUS) Z8.5(Vp)
+3V3: C28.2 C29.2 C32.2 C34.2 C36.2 D12.2(A2) D13.2(A2) J2.1 L3.1 P5.1(VTref) R46.2 R49.2 R52.2 R58.2 R59.2 R60.2 R64.1 R65.2 R66.2 R67.2 U6.12(PIN) U6.13(SPD) U6.14(Vdd2) U6.16(Vbus2) U7.1(Vdd) U7.5(Vout33) U7.6(VRegin) U7.9(VddA) U7.16(Vbat) U7.22(Vdd)
EARTH: P4.1
GND: C28.1 C29.1 C30.1 C31.1 C32.1 C33.1 C34.1 C35.1 C36.1 D12.1(A1) D13.1(A1) D14.K D15.K Gnd.1(TP) J2.4 OLED1.1(CS) OLED1.2(DC) OLED1.7(Gnd) P4.2 P5.0(Pins) P5.3(Gnd) P5.5(Gnd) P5.9(GndDet) S1.1 S1.1b S2.1 S2.1b S3.1 S3.1b U6.9(Gnd2b) U6.15(Gnd2a) U7.2(Vss) U7.11(VRefL) U7.12(VssA) U7.23(Vss) U8.2(A) Y1.2(Gnd) Y1.4(Gnd)
Gnd_USB: C26.1 C27.1 R50.2 R53.2 U6.2(Gnd1a) U6.8(Gnd1b) USB1.A1(GND) USB1.A12(GND) USB1.B1(GND) USB1.B12(GND) USB1.SH(SHIELD) Z8.2(Vn)
AC_REF: U7.40(PTC7) ; port AC_REF
BIAS_En: U7.48(PTD7) ; port BIAS_En
CH1_BTN: R52.1 S3.2 U7.43(PTD2/LL_WU_P13)
CH1_SB: D13.3(K) R51.1 U7.31(PTB16)
CH1_SEL: R57.1 U7.33(PTC0)
CH1a_DRVn: U7.34(PTC1/LLWU_P6) ; port CH1a_DRVn
CH1b_DRVn: U7.35(PTC2) ; port CH1b_DRVn
CH2_BTN: R49.1 S2.2 U7.42(PTD1)
CH2_SB: D12.3(K) R54.1 U7.32(PTB17)
CH2_SEL: R61.2 U7.39(PTC6/LLWU_P10)
CH2a_DRVn: U7.36(PTC3/LLWU_P7) ; port CH2a_DRVn
CH2b_DRVn: U7.37(PTC4/LLWU_P8) ; port CH2b_DRVn
Clamp: U7.38(PTC5/LLWU_P9) ; port Clamp
EXTAL: U7.24(PTA18/EXTAL) Y1.3(OSC2)
EXTAL32: U7.15(EXTAL32)
GAIN: U7.45(PTD4/LLWU_P14) ; port GAIN
HIGH_G_AMP: U7.7(ADC0_DP0) ; port HIGH_G_AMP
LOW_G_AMP: U7.8(ADC0_DM0) ; port LOW_G_AMP
MUX_SEL0/ID1: U7.46(PTD5) ; port MUX_SEL0/ID1
MUX_SEL1/ID2: U7.47(PTD6/LLWU_P15) ; port MUX_SEL1/ID2
OVERCURRENT: U7.13(VRefout/CMP1_IN5/CMP0_IN5) ; port OVERCURRENT
QUAD_A: C30.2 R58.1 R63.2 U7.28(PTB1)
QUAD_B: C31.2 R60.1 R62.2 U7.27(PTB0/LLWU_P5)
QUAD_BTN: P4.4 R59.1 U7.41(PTD0/LLWU_P12)
RESETb: OLED1.3(Reset) P5.10(nRESET) R67.1 U7.26(RESETb)
SCL: OLED1.5(SCL) R66.1 SCL.1(TP) U7.29(PTB2)
SDA: OLED1.4(SDA) R65.1 SDA.1(TP) U7.30(PTB3)
SEL_BTN: R46.1 S1.2 U7.44(PTD3)
SPARE1: T1.1(TP) U7.21(PTA4/LLWU_P3)
SWD_CLK: P5.4(SWDCLK) U7.17(PTA0)
SWD_DIO: P5.2(SDWIO) U7.20(PTA3)
SWD_Rx: P5.8(NC/EXTb) U7.18(PTA1)
SWD_Tx: P5.6(SWO/EXTa) U7.19(PTA2)
USBD_N: R55.2 U7.4(USB0_DM)
USBD_P: R56.2 U7.3(USB0_DP)
USBD_R_N: R48.2 USB1.A7(DM1) USB1.B7(DM2) Z8.3
USBD_R_P: R47.2 USB1.A6(DP1) USB1.B6(DP2) Z8.1
Vdd1: C27.2 U6.3(Vdd1) U6.4(PDEN) U6.5(SPU)
VrefH: C33.2 R64.2 U7.10(VRefH) U8.1(K)
XTAL: U7.25(PTA19/XTAL) Y1.1(OSC1)
XTAL32: U7.14(XTAL32)
NetC35_2: C35.2 L3.2 OLED1.6(Vcc)
NetD14_A: D14.A R57.2
NetD15_A: D15.A R61.1
NetJ2_2: J2.2 R51.2
NetJ2_3: J2.3 R54.2
NetP4_3: P4.3 R63.1
NetP4_5: P4.5 R62.1
NetR47_1: R47.1 U6.7(UD+)
NetR48_1: R48.1 U6.6(UD-)
NetR50_1: R50.1 USB1.A5(CC1)
NetR53_1: R53.1 USB1.B5(CC2)
NetR55_1: R55.1 U6.11(DD-)
NetR56_1: R56.1 U6.10(DD+)

Not connected (* = marked no-connect by the designer): S1 2b; S2 2b; S3 2b; U8 3(NC); USB1 A8(SBUS1) B8(SBUS2); Z8 4 6

### Notes on the sheet
- (near C33) 3.0V
- (in symbol CM1293A-04SO) Vdd; Gnd
- (in symbol OSHW Logo) O
- (in symbol SWD2X5_JIG) Key

### Library data of the parts
C26-C29 C33 C34 C36 = Cap_CCNP_0603_100nF: as C1 on sheet SolderingStation_Control; Published: 08/06/2000; Publisher: Altium Hobart Technology Centre; SubClass: Capacitor; Farnell PN: *; Digikey: *; Value: 100nF; LCSC: C14663
C30 C31 = Cap_CCNP_0603_1nF: Capacitor non-polar SMT 0603; Manufacturer: Generic Components; Class: Passive; Published: 08/06/2000; Publisher: Altium Hobart Technology Centre; SubClass: Capacitor; Farnell PN: *; Digikey: *; Value: 1nF; LCSC: C1588
C32 = Cap_CCNP_0603_2u2F: Capacitor non-polar SMT 0603; Manufacturer: Generic Components; Class: Passive; Published: 08/06/2000; Publisher: Altium Hobart Technology Centre; SubClass: Capacitor; Farnell PN: *; Digikey: *; Value: 2.2nF; LCSC: C23630
C35 = Cap_CCNP_0805_10uF: as C22 on sheet SolderingStation_Power; Published: 08/06/2000; Publisher: Altium Hobart Technology Centre; SubClass: Capacitor; Farnell PN: *; Digikey: *; Value: 10uF; LCSC: C15850
D12 D13 = BAV199LT1G: as D11 on sheet SolderingStation_Power; Digikey: BAV199LT1GOSCT-ND; Farnell PN: 1431115; LCSC: C145516
D14 D15 = LED_3MM_RED: 3mm Red LED; Manufacturer: Generic Components; Class I: Optoelectronic; Published: 8-Jun-2000; Revision: July-2002: Re-released for DXP Platform.; Publisher: Altium Limited; Class II: LED; Digikey: *; Farnell PN: *; LCSC: *
Gnd SCL SDA T1 = TP: Test Point; Digikey: *; Farnell PN: *; LCSC: *
J2 = JST-B4B-XH-A: LatestRevisionDate: 17-Jul-2002; LatestRevisionNote: Re-released for DXP Platform.; Publisher: Altium Limited; LCSC: *; Farnell PN: 1516278; Digikey: 455-2249-ND
L3 = Ferrite Bead 0805: as L1 on sheet SolderingStation_Control; Farnell PN: 1669733; Digikey: *; LCSC: C1017
OLED1 = OLED_Display_128x64_2.4inch: OLED Display 128x64 pixels, 2.4inch; LCSC: *
P4 = Header 1x5: LatestRevisionDate: 17-Jul-2002; LatestRevisionNote: Re-released for DXP Platform.; Publisher: Altium Limited; LCSC: *
P5 = SWD2X5_JIG: LatestRevisionDate: 17-Jul-2002; LatestRevisionNote: Re-released for DXP Platform.; Publisher: Altium Limited; Farnell PN: 1865285; LCSC: *
R46 R49 R52 R58-R60 R67 = Res_CR0603_10k: as R11 on sheet SolderingStation_Control; Published: 08/06/2000; Publisher: Altium Hobart Technology Centre; SubClass: Resistor; Farnell PN: *; Digikey: *; Value: 10k; LCSC: C25804
R47 R48 R55 R56 R62 R63 = Res_CR0603_33R: Resistor SMT 0603; Manufacturer: Generic Components; Class: Passive; Published: 08/06/2000; Publisher: Altium Hobart Technology Centre; SubClass: Resistor; Farnell PN: *; Digikey: *; Value: 33R; LCSC: C23140
R50 R53 = Res_CR0603_5k1: as R25 on sheet SolderingStation_Control; Published: 08/06/2000; Publisher: Altium Hobart Technology Centre; SubClass: Resistor; Farnell PN: *; Digikey: *; Value: 5.1k; LCSC: C23186
R51 R54 R64 = Res_CR0603_1k: as R21 on sheet SolderingStation_Control; Published: 08/06/2000; Publisher: Altium Hobart Technology Centre; SubClass: Resistor; Farnell PN: *; Digikey: *; Value: 1k; LCSC: C21190
R57 R61 = Res_CR0603_470R: as R9 on sheet SolderingStation_Control; Published: 08/06/2000; Publisher: Altium Hobart Technology Centre; SubClass: Resistor; Farnell PN: *; Digikey: *; Value: 470R; LCSC: C23179
R65 R66 = Res_CR0603_4k7: as R1 on sheet SolderingStation_Control; Published: 08/06/2000; Publisher: Altium Hobart Technology Centre; SubClass: Resistor; Farnell PN: *; Digikey: *; Value: 4.7k; LCSC: C23162
S1-S3 = SW_PB-B3F1052: Switch miniature push-button; Manufacturer: Generic Components; Published: 24-Mar-1999; Revision: July-2002: Re-released for DXP Platform.; Publisher: Altium Limited; Farnell PN: 196094202; LCSC: *
SC1-SC3 = Switch-Cap - B32-2010: Switch Cap; Farnell PN: 2352313
U6 = ADuM4160BRIZ: Full/Low Speed 5 kV USB Digital Isolator; Farnell PN: 2061081
U7 = MK20DX128VLF5: Kinetis K20: 50MHz Cortex-M4 Performance MCU, 160KB Flash, 16KB SRAM, Full-Speed USB, 48-LQFP; Farnell PN: 2133571; Digikey: MK20DX128VLF50-ND; Mouser: 841-MK20DX128VLF5; LCSC: *
U8 = LM4040BIM3-2.5/NOPB: IC 2.5V VREF SHUNT 0.2% SOT23-3; Digikey: LM4040BIM3X-2.5/NOPBCT-ND; Farnell PN: 3124419; LCSC: C131939
USB1 = USB4085-GF-A: USB-C, USB 2.0 Receptacle Connector 16 Position Through Hole, Right Angle; Angle: 90; Part Number: USB4085-GF-A; Digikey Part Number: 2073-USB4085-GF-ACT-ND; Digikey Link: https://www.digikey.ee/product-detail/en/gct/USB4085-GF-A/2073-USB4085-GF-ACT-ND/9859733; Farnell PN: 2924867; Digikey: 2073-USB4085-GF-ACT-ND; LCSC: *
Y1 = Crystal 16MHz: Crystal SMD 3.2 x 2.5 x 0.7 mm; Manufacturer: Generic Components; Class: Oscillator; SubClass: Crystal Oscillator; Published: 08/06/2000; Publisher: Altium Hobart Technology Centre; Digikey: *; Farnell PN: *; LCSC: C13738
Z8 = CM1293A-04SO: Ultra low capacitance quadruple rail-to-rail ESD protection; Farnell PN: 2533258; Digikey: CM1293A-04SOOSCT-ND; LCSC: C393377

## Nets that join several sheets
+3V3: SolderingStation_Control (11 pins), SolderingStation_Power (+3V3.1 C22.2 D11.2 U4.4), SolderingStation_Processor (30 pins)
+9V: SolderingStation_Control (R16.1), SolderingStation_Power (5 pins)
-5V: SolderingStation_Control (11 pins), SolderingStation_Power (-5V.1 C25.2 U5.1)
EARTH: SolderingStation_Control (ER.1 L2.1), SolderingStation_Processor (P4.1)
GND: SolderingStation_Control (37 pins), SolderingStation_Power (11 pins), SolderingStation_Processor (38 pins)
Vnn: SolderingStation_Control (C9.2 R14.2 R17.1), SolderingStation_Power (8 pins)
Vpp: SolderingStation_Control (12 pins), SolderingStation_Power (9 pins)
AC_REF: SolderingStation_Power (AC_REF.1 D11.3 R40.2 R41.2), SolderingStation_Processor (U7.40)
BIAS_En: SolderingStation_Control (R18.2), SolderingStation_Processor (U7.48)
CH1a_DRVn: SolderingStation_Control (D1a.1 Q5.2), SolderingStation_Processor (U7.34)
CH1b_DRVn: SolderingStation_Control (D1b.1 Q6.2), SolderingStation_Processor (U7.35)
CH2a_DRVn: SolderingStation_Control (D2a.1 Q3.2), SolderingStation_Processor (U7.36)
CH2b_DRVn: SolderingStation_Control (D2b.1 Q4.2), SolderingStation_Processor (U7.37)
Clamp: SolderingStation_Control (Q18.1), SolderingStation_Processor (U7.38)
GAIN: SolderingStation_Control (R33.2), SolderingStation_Processor (U7.45)
HIGH_G_AMP: SolderingStation_Control (D8.K HGA.1 R20.1), SolderingStation_Processor (U7.7)
LOW_G_AMP: SolderingStation_Control (D10.K LGA.1 R27.1), SolderingStation_Processor (U7.8)
MUX_SEL0/ID1: SolderingStation_Control (R39.2 U3.9), SolderingStation_Processor (U7.46)
MUX_SEL1/ID2: SolderingStation_Control (R37.2 U3.10), SolderingStation_Processor (U7.47)
OVERCURRENT: SolderingStation_Control (C10.2 OC.1 R15.2 U1.4), SolderingStation_Processor (U7.13)